# Altium schematic sheet A dashBoard of Stepper Motor Driver With DRV8825.SchDoc
size A4
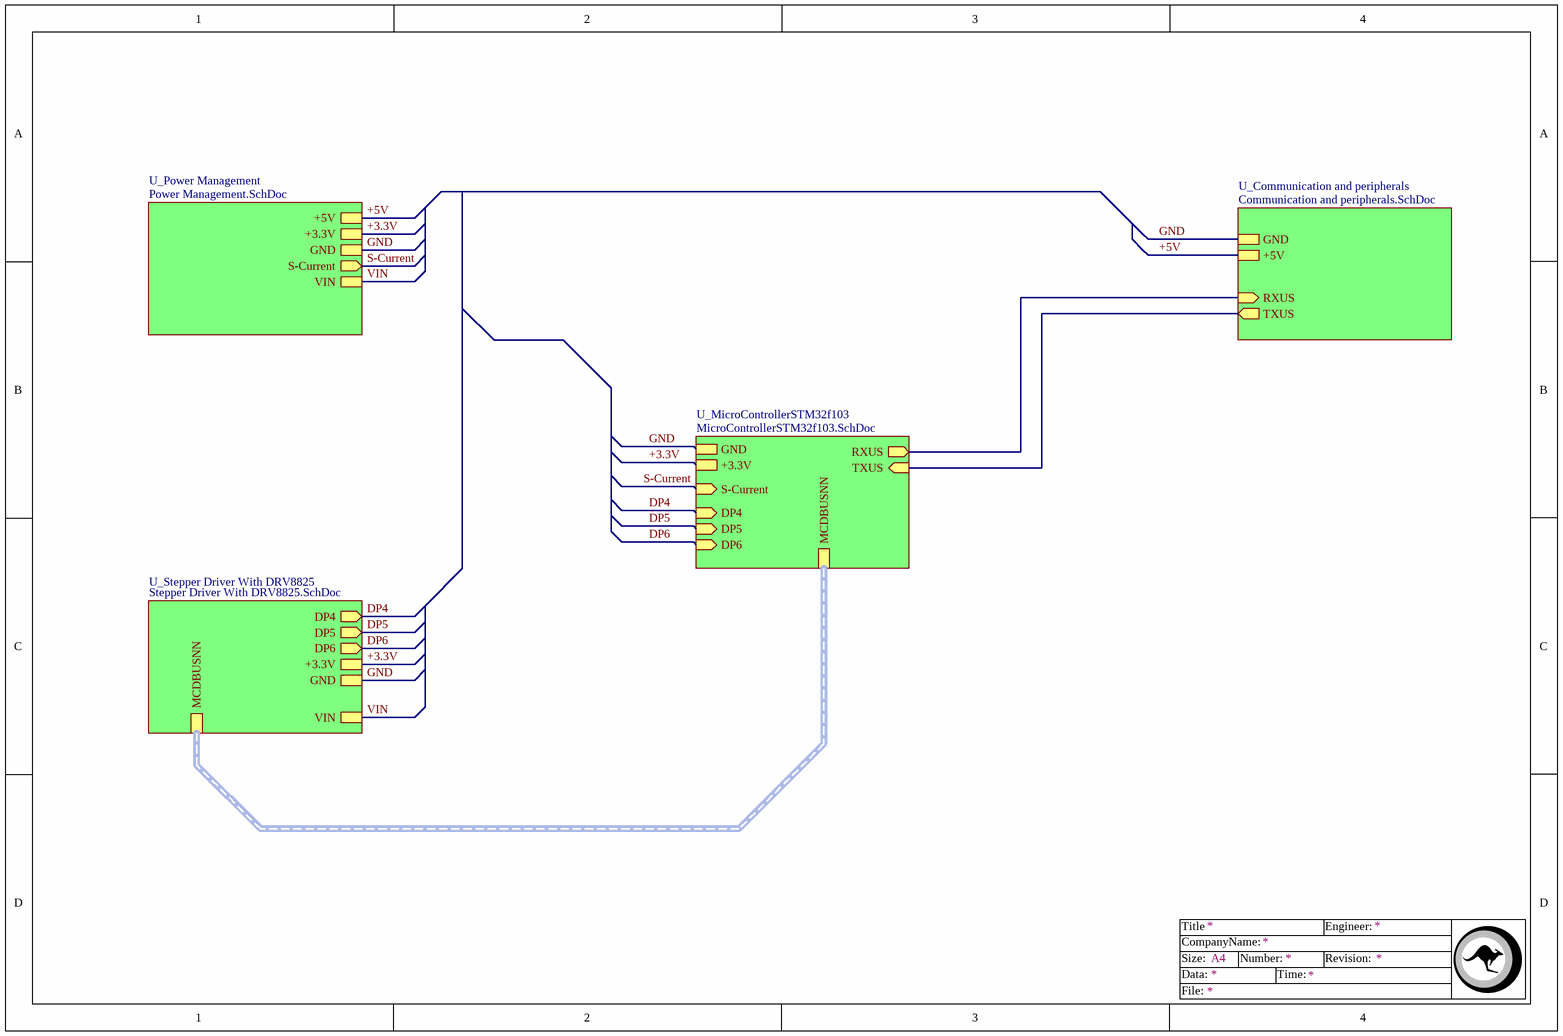
[diagram p0: A dashBoard of Stepper Motor Driver With DRV8825.SchDoc]

## Sub-sheets
U_Communication and peripherals = Communication and peripherals.SchDoc: TXUS (out), RXUS (in), GND, +5V
U_MicroControllerSTM32f103 = MicroControllerSTM32f103.SchDoc: GND, +3.3V, RXUS (out), TXUS (in), DP4 (in), DP5 (in), DP6 (in), MCDBUSNN (harness MCDBUSNN), S-Current (in)
U_Power Management = Power Management.SchDoc: +5V, +3.3V, GND, S-Current (out), VIN
U_Stepper Driver With DRV8825 = Stepper Driver With DRV8825.SchDoc: VIN, DP4 (out), DP5 (out), DP6 (out), GND, +3.3V, MCDBUSNN (harness MCDBUSNN)

## Nets
+3.3V: sheet U_Power Management/+3.3V, sheet U_MicroControllerSTM32f103/+3.3V, sheet U_Stepper Driver With DRV8825/+3.3V
+5V: sheet U_Communication and peripherals/+5V, sheet U_Power Management/+5V
DP4: sheet U_MicroControllerSTM32f103/DP4, sheet U_Stepper Driver With DRV8825/DP4
DP5: sheet U_MicroControllerSTM32f103/DP5, sheet U_Stepper Driver With DRV8825/DP5
DP6: sheet U_MicroControllerSTM32f103/DP6, sheet U_Stepper Driver With DRV8825/DP6
GND: sheet U_Communication and peripherals/GND, sheet U_Power Management/GND, sheet U_MicroControllerSTM32f103/GND, sheet U_Stepper Driver With DRV8825/GND
S-Current: sheet U_Power Management/S-Current, sheet U_MicroControllerSTM32f103/S-Current
VIN: sheet U_Power Management/VIN, sheet U_Stepper Driver With DRV8825/VIN
(unnamed): sheet U_Communication and peripherals/TXUS, sheet U_MicroControllerSTM32f103/TXUS
(unnamed): sheet U_Communication and peripherals/RXUS, sheet U_MicroControllerSTM32f103/RXUS

## Buses and harness runs
harness sheet U_MicroControllerSTM32f103/MCDBUSNN = sheet U_Stepper Driver With DRV8825/MCDBUSNN

## Notes on the sheet
- Title
- Size:
- Data:
- CompanyName:
- A4
- Number:
- Time:
- Revision:
- Engineer:
- File: